# Altium schematic sheet Connector.SchDoc
size A4
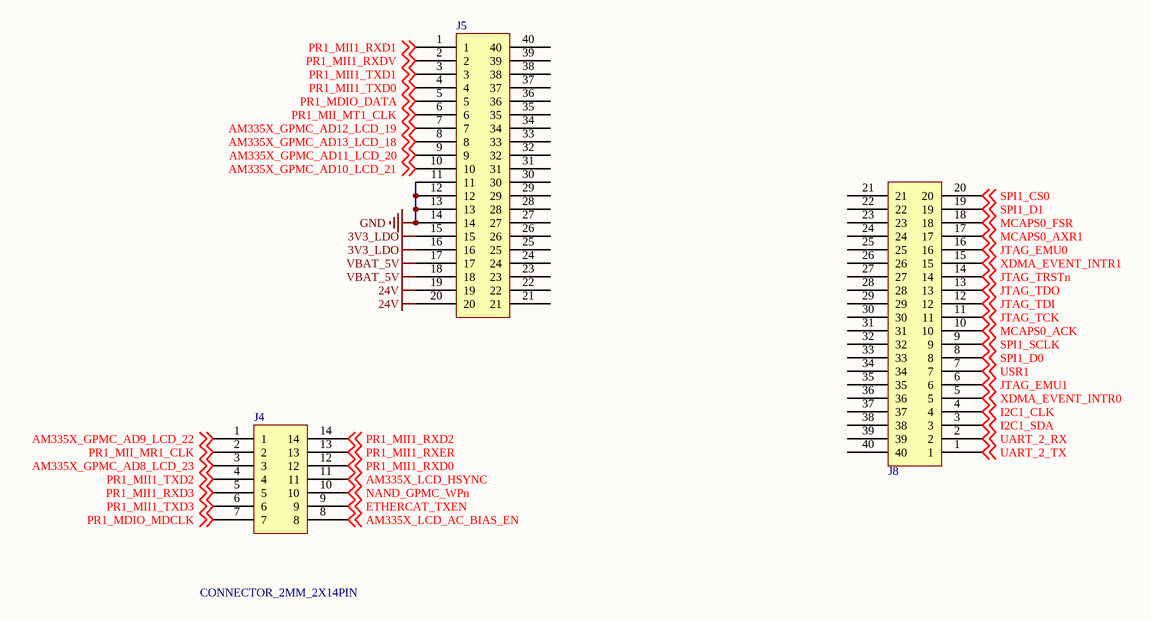
[diagram p0: Connector.SchDoc]

## Parts
J4  CONNECTOR_2MM_2X14PIN  [JTAG,0.254_G]
J5  CONNECTOR_2MM_2X20PIN  [JTAG,0.254 double]  (value not drawn)
J8  CONNECTOR_2MM_2X20PIN  [JTAG,0.254 double]  (value not drawn)

## Nets
3V3_LDO: J5.15 J5.16
24V: J5.19 J5.20
GND: J5.11 J5.12 J5.13 J5.14
VBAT_5V: J5.17 J5.18
AM335X_GPMC_AD8_LCD_23: J4.3 ; off-sheet AM335X_GPMC_AD8_LCD_23
AM335X_GPMC_AD9_LCD_22: J4.1 ; off-sheet AM335X_GPMC_AD9_LCD_22
AM335X_GPMC_AD10_LCD_21: J5.10 ; off-sheet AM335X_GPMC_AD10_LCD_21
AM335X_GPMC_AD11_LCD_20: J5.9 ; off-sheet AM335X_GPMC_AD11_LCD_20
AM335X_GPMC_AD12_LCD_19: J5.7 ; off-sheet AM335X_GPMC_AD12_LCD_19
AM335X_GPMC_AD13_LCD_18: J5.8 ; off-sheet AM335X_GPMC_AD13_LCD_18
AM335X_LCD_AC_BIAS_EN: J4.8 ; off-sheet AM335X_LCD_AC_BIAS_EN
AM335X_LCD_HSYNC: J4.11 ; off-sheet AM335X_LCD_HSYNC
ETHERCAT_TXEN: J4.9 ; off-sheet ETHERCAT_TXEN
I2C1_CLK: J8.4 ; off-sheet I2C1_CLK
I2C1_SDA: J8.3 ; off-sheet I2C1_SDA
JTAG_EMU0: J8.16 ; off-sheet JTAG_EMU0
JTAG_EMU1: J8.6 ; off-sheet JTAG_EMU1
JTAG_TCK: J8.11 ; off-sheet JTAG_TCK
JTAG_TDI: J8.12 ; off-sheet JTAG_TDI
JTAG_TDO: J8.13 ; off-sheet JTAG_TDO
JTAG_TRSTn: J8.14 ; off-sheet JTAG_TRSTn
MCAPS0_ACK: J8.10 ; off-sheet MCAPS0_ACK
MCAPS0_AXR1: J8.17 ; off-sheet MCAPS0_AXR1
MCAPS0_FSR: J8.18 ; off-sheet MCAPS0_FSR
NAND_GPMC_WPn: J4.10 ; off-sheet NAND_GPMC_WPn
PR1_MDIO_DATA: J5.5 ; off-sheet PR1_MDIO_DATA
PR1_MDIO_MDCLK: J4.7 ; off-sheet PR1_MDIO_MDCLK
PR1_MII1_RXD0: J4.12 ; off-sheet PR1_MII1_RXD0
PR1_MII1_RXD1: J5.1 ; off-sheet PR1_MII1_RXD1
PR1_MII1_RXD2: J4.14 ; off-sheet PR1_MII1_RXD2
PR1_MII1_RXD3: J4.5 ; off-sheet PR1_MII1_RXD3
PR1_MII1_RXDV: J5.2 ; off-sheet PR1_MII1_RXDV
PR1_MII1_RXER: J4.13 ; off-sheet PR1_MII1_RXER
PR1_MII1_TXD0: J5.4 ; off-sheet PR1_MII1_TXD0
PR1_MII1_TXD1: J5.3 ; off-sheet PR1_MII1_TXD1
PR1_MII1_TXD2: J4.4 ; off-sheet PR1_MII1_TXD2
PR1_MII1_TXD3: J4.6 ; off-sheet PR1_MII1_TXD3
PR1_MII_MR1_CLK: J4.2 ; off-sheet PR1_MII_MR1_CLK
PR1_MII_MT1_CLK: J5.6 ; off-sheet PR1_MII_MT1_CLK
SPI1_CS0: J8.20 ; off-sheet SPI1_CS0
SPI1_D0: J8.8 ; off-sheet SPI1_D0
SPI1_D1: J8.19 ; off-sheet SPI1_D1
SPI1_SCLK: J8.9 ; off-sheet SPI1_SCLK
UART_2_RX: J8.2 ; off-sheet UART_2_RX
UART_2_TX: J8.1 ; off-sheet UART_2_TX
USR1: J8.7 ; off-sheet USR1
XDMA_EVENT_INTR0: J8.5 ; off-sheet XDMA_EVENT_INTR0
XDMA_EVENT_INTR1: J8.15 ; off-sheet XDMA_EVENT_INTR1

Not connected (* = marked no-connect by the designer): J5 21 22 23 24 25 26 27 28 29 30 31 32 33 34 35 36 37 38 39 40; J8 21 22 23 24 25 26 27 28 29 30 31 32 33 34 35 36 37 38 39 40